# Altium schematic sheet BMS.SchDoc
size A; SheetNumber: 1
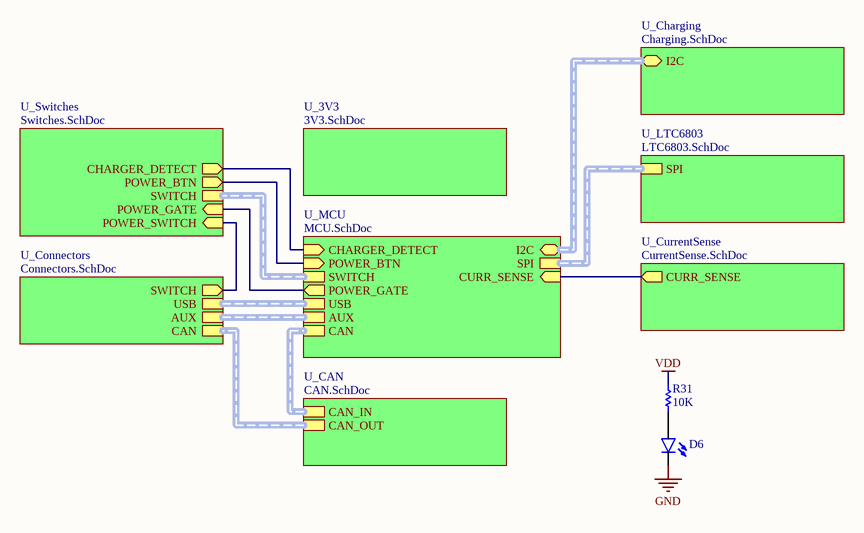
[diagram p0: BMS.SchDoc]

## Parts
D6  LED-BLUE  [LED0603]  (value not drawn)
R31  value 10K  [R0603[1608]]  (hidden comment: 10K 5% 0603)

## Sub-sheets
U_3V3 = 3V3.SchDoc: no entries
U_CAN = CAN.SchDoc: CAN_IN (harness CAN Input), CAN_OUT (harness CAN Output)
U_Charging = Charging.SchDoc: I2C (harness I2C)
U_Connectors = Connectors.SchDoc: USB (harness USB), AUX (harness Auxiliary Outputs), SWITCH (out), CAN (harness CAN Output)
U_CurrentSense = CurrentSense.SchDoc: CURR_SENSE (out)
U_LTC6803 = LTC6803.SchDoc: SPI (harness SPI)
U_MCU = MCU.SchDoc: CHARGER_DETECT (in), POWER_BTN (in), POWER_GATE (out), SPI (harness SPI), USB (harness USB), CAN (harness CAN Input), AUX (harness Auxiliary Outputs), SWITCH (harness Switches), CURR_SENSE (in), I2C (harness I2C)
U_Switches = Switches.SchDoc: POWER_GATE (in), POWER_BTN (out), CHARGER_DETECT (out), SWITCH (harness Switches), POWER_SWITCH (in)

## Nets
GND: D6.C
VDD: R31.2
NetD6_A: D6.A R31.1
(unnamed): sheet U_MCU/CHARGER_DETECT, sheet U_Switches/CHARGER_DETECT
(unnamed): sheet U_MCU/POWER_BTN, sheet U_Switches/POWER_BTN
(unnamed): sheet U_MCU/POWER_GATE, sheet U_Switches/POWER_GATE
(unnamed): sheet U_MCU/CURR_SENSE, sheet U_CurrentSense/CURR_SENSE
(unnamed): sheet U_Switches/POWER_SWITCH, sheet U_Connectors/SWITCH

## Buses and harness runs
harness sheet U_CAN/CAN_IN = sheet U_MCU/CAN
harness sheet U_CAN/CAN_OUT = sheet U_Connectors/CAN
harness sheet U_Charging/I2C = sheet U_MCU/I2C
harness sheet U_Connectors/AUX = sheet U_MCU/AUX
harness sheet U_Connectors/USB = sheet U_MCU/USB
harness sheet U_LTC6803/SPI = sheet U_MCU/SPI
harness sheet U_MCU/SWITCH = sheet U_Switches/SWITCH

## Library data of the parts
D6 = LED_0603: PartNumber: LTST-C193TBKT-5A; Manufacturer: Lite-On Inc.; PackageReference: 0603; PackageDescription: 0603 (1608 Metric); Mounting Technology: Surface Mount
R31 = RES_10K_0603_5%: 10K 0.25W 5% 0603 (1005 Metric); Manufacturer: Vishay; PartNumber: RCS060310K0JNEA; Tolerance: 5%; Power: 0.25W; Mounting Technology: Surface Mount; PackageReference: 0603; PackageDescription: 0603 (1608 Metric); ComponentLink1Description: Datasheet; ComponentLink1URL: http://www.vishay.com/docs/20065/rcse3.pdf